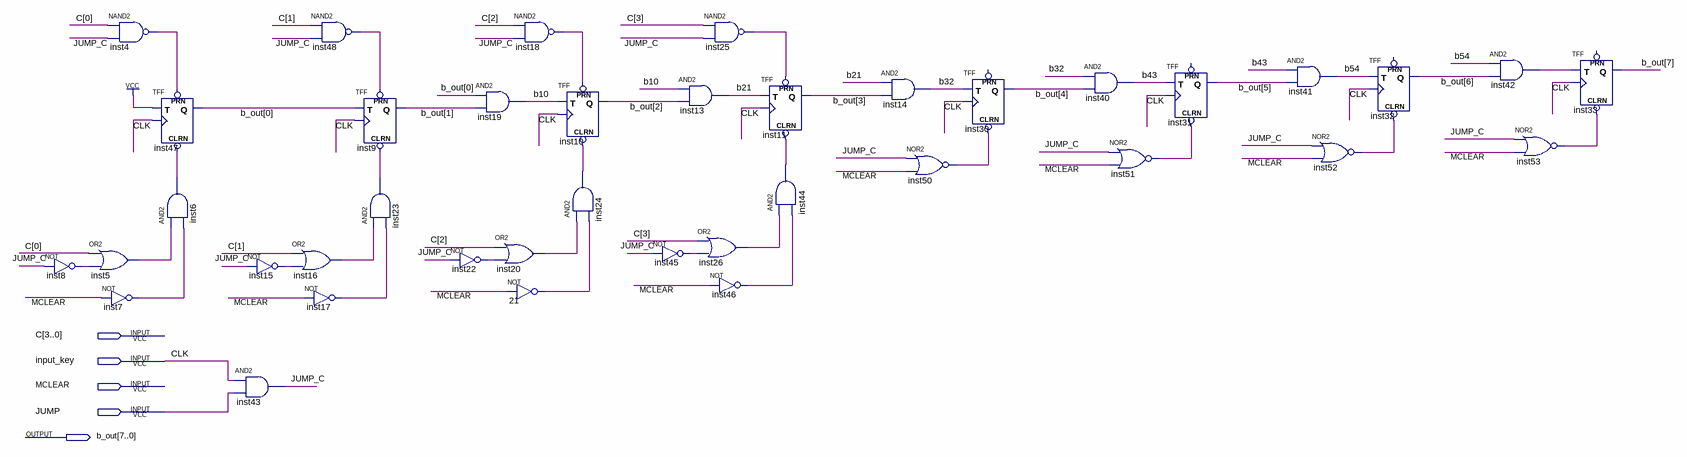
[diagram p0: schematic sheet]
// Quartus schematic Count8.bdf as structural Verilog: 39 symbols, 5 pins
module Count8 (
  input  [3:0] C,
  input  input_key,
  input  MCLEAR,
  input  JUMP,
  output [7:0] b_out
);

  wire b10, b21, b32, b43, b54, inst4_out, inst5_out, inst6_out, inst7_out, inst8_out, inst15_out,
       inst16_out, inst17_out, inst18_out, inst20_out, inst22_out, inst23_out, inst24_out, inst25_out,
       inst26_out, inst42_out, inst44_out, inst45_out, inst46_out, inst48_out, inst50_out, inst51_out,
       inst52_out, inst53_out, JUMP_C, n21_out;

  not inst8 (inst8_out, JUMP_C);
  or inst5 (inst5_out, C[0], inst8_out);
  nand inst4 (inst4_out, C[0], JUMP_C);
  not inst7 (inst7_out, MCLEAR);
  TFF inst47 (.PRN(inst4_out), .CLRN(inst6_out), .T(1'b1), .CLK(input_key), .Q(b_out[0]));
  and inst6 (inst6_out, inst5_out, inst7_out);
  not inst15 (inst15_out, JUMP_C);
  and inst43 (JUMP_C, input_key, JUMP);
  or inst16 (inst16_out, C[1], inst15_out);
  nand inst48 (inst48_out, C[1], JUMP_C);
  not inst17 (inst17_out, MCLEAR);
  TFF inst9 (.PRN(inst48_out), .CLRN(inst23_out), .T(b_out[0]), .CLK(input_key), .Q(b_out[1]));
  and inst23 (inst23_out, inst16_out, inst17_out);
  not inst22 (inst22_out, JUMP_C);
  and inst19 (b10, b_out[0], b_out[1]);
  or inst20 (inst20_out, C[2], inst22_out);
  nand inst18 (inst18_out, C[2], JUMP_C);
  not u_21 (n21_out, MCLEAR);
  TFF inst10 (.PRN(inst18_out), .CLRN(inst24_out), .T(b10), .CLK(input_key), .Q(b_out[2]));
  and inst24 (inst24_out, inst20_out, n21_out);
  not inst45 (inst45_out, JUMP_C);
  nand inst25 (inst25_out, C[3], JUMP_C);
  and inst13 (b21, b10, b_out[2]);
  or inst26 (inst26_out, C[3], inst45_out);
  not inst46 (inst46_out, MCLEAR);
  TFF inst11 (.PRN(inst25_out), .CLRN(inst44_out), .T(b21), .CLK(input_key), .Q(b_out[3]));
  and inst44 (inst44_out, inst26_out, inst46_out);
  and inst14 (b32, b21, b_out[3]);
  nor inst50 (inst50_out, JUMP_C, MCLEAR);
  TFF inst30 (.CLRN(inst50_out), .T(b32), .CLK(input_key), .Q(b_out[4]));  // open: PRN
  and inst40 (b43, b32, b_out[4]);
  nor inst51 (inst51_out, JUMP_C, MCLEAR);
  TFF inst31 (.CLRN(inst51_out), .T(b43), .CLK(input_key), .Q(b_out[5]));  // open: PRN
  and inst41 (b54, b43, b_out[5]);
  nor inst52 (inst52_out, JUMP_C, MCLEAR);
  TFF inst32 (.CLRN(inst52_out), .T(b54), .CLK(input_key), .Q(b_out[6]));  // open: PRN
  and inst42 (inst42_out, b54, b_out[6]);
  nor inst53 (inst53_out, JUMP_C, MCLEAR);
  TFF inst33 (.CLRN(inst53_out), .T(inst42_out), .CLK(input_key), .Q(b_out[7]));  // open: PRN

  // Other names for the same wires on the sheet: CLK = input_key
endmodule
